# EAGLE design backup_board (EAGLE 7.7.0)
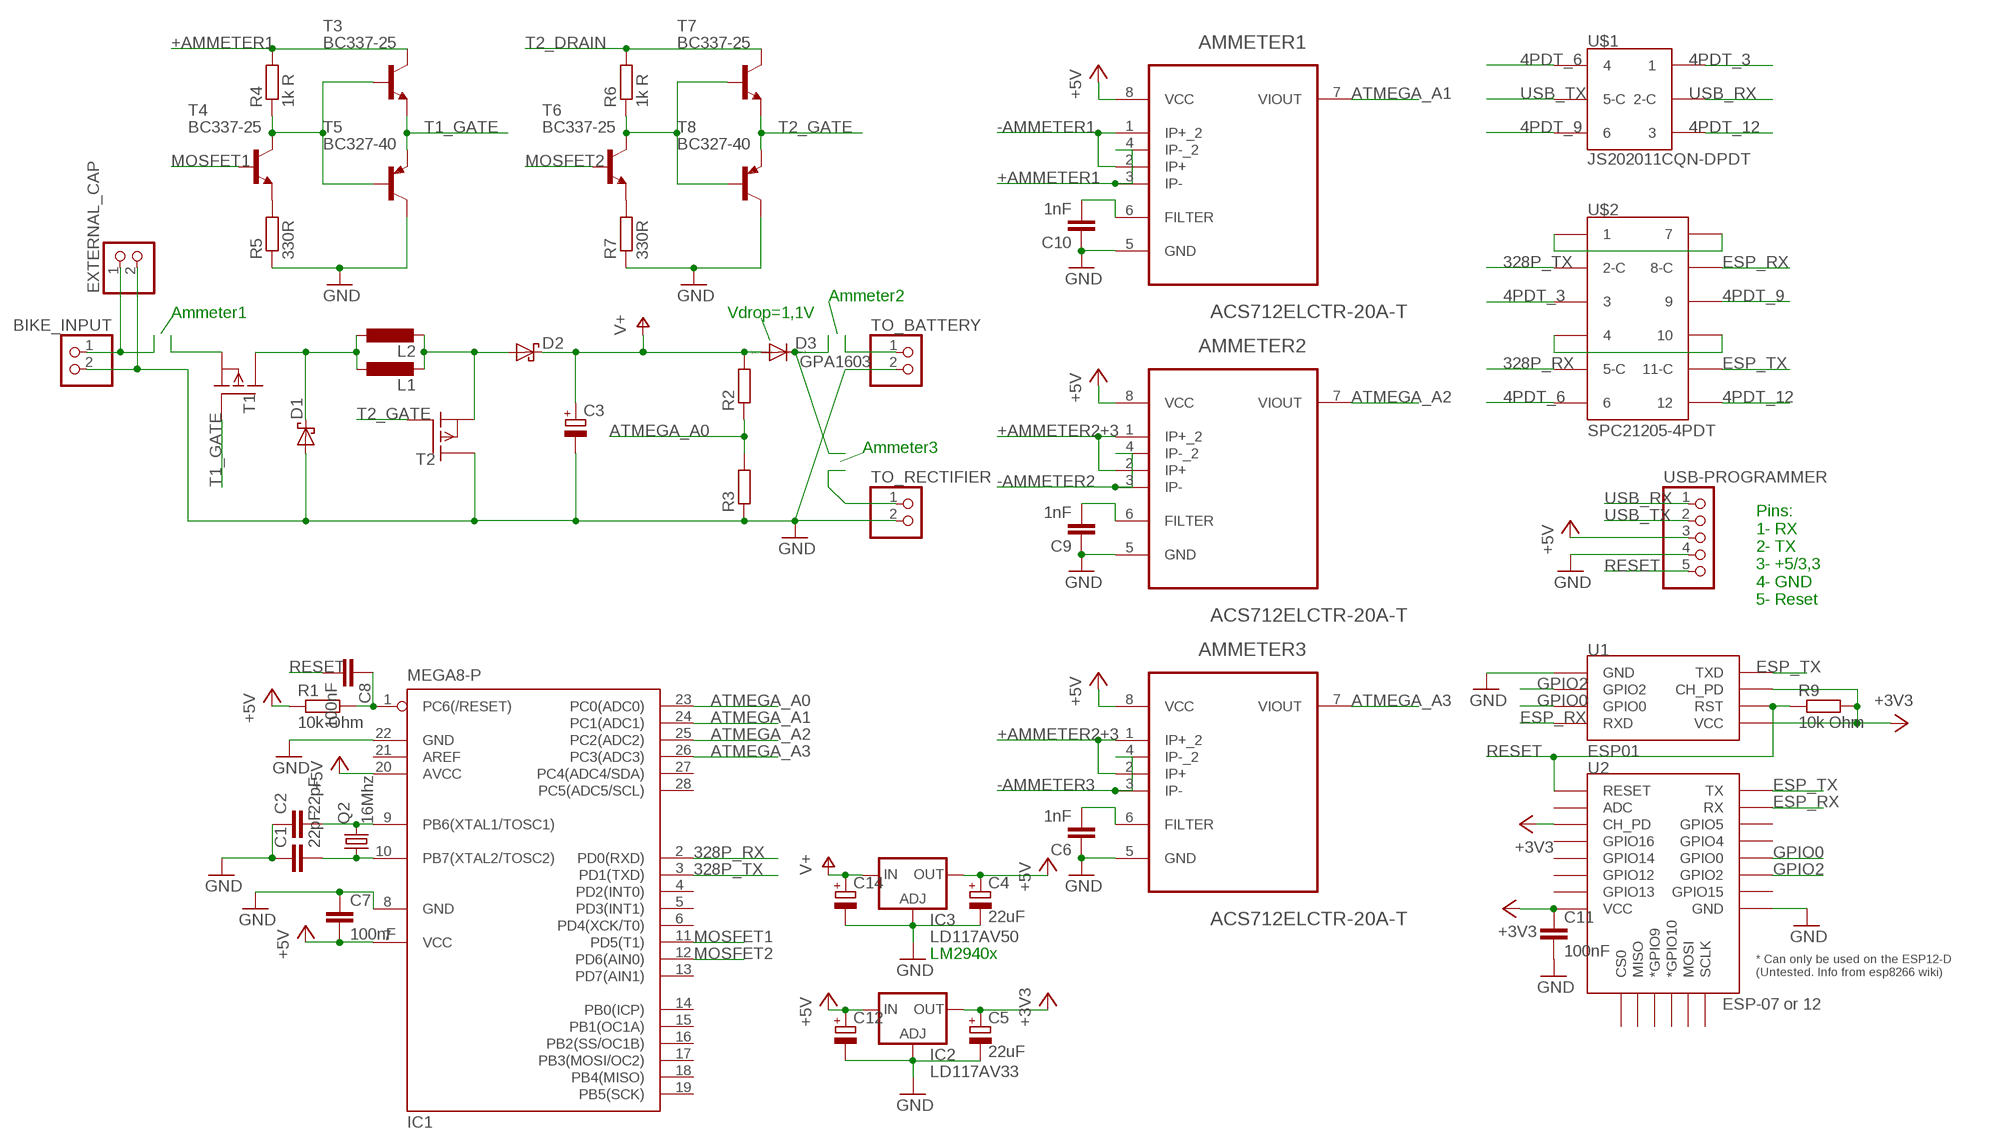
[diagram p0: schematic, sheet 1]

## Parts
AMMETER1  ACS712ELCTR-20A-T  [SOIC127P600X175-8N]
AMMETER2  ACS712ELCTR-20A-T  [SOIC127P600X175-8N]
AMMETER3  ACS712ELCTR-20A-T  [SOIC127P600X175-8N]
BIKE_INPUT  PINHD-1X2  [1X02]
C1  22pF  C-EU025-024X044  [C025-024X044]
C2  22pF  C-EU025-024X044  [C025-024X044]
C3  CPOL-EUE3.5-8  [E3,5-8]
C4  22uF  CPOL-EUE1.8-4  [E1,8-4]
C5  22uF  CPOL-EUE1.8-4  [E1,8-4]
C6  1nF  C-EU025-024X044  [C025-024X044]
C7  100nF  C-EU025-024X044  [C025-024X044]
C8  100nF  C-EU025-025X050  [C025-025X050]
C9  1nF  C-EU025-024X044  [C025-024X044]
C10  1nF  C-EU025-024X044  [C025-024X044]
C11  100nF  C-EU025-024X044  [C025-024X044]
C12  CPOL-EUE3.5-8  [E3,5-8]
C14  CPOL-EUE3.5-8  [E3,5-8]
D1  STPS1045  [TO220AC]
D2  STPS1045  [TO220AC]
D3  GPA1603  DIODE-C221B1A  [C221B1A]
EXTERNAL_CAP  PINHD-1X2  [1X02]
IC1  MEGA8-P  [DIL28-3]
IC2  LD117AV33  [TO220L1]
IC3  LD117AV50  [TO220L1]
L1  L-EUTJ4-U2  [TJ4-U2]
L2  L-EUTJ4-U2  [TJ4-U2]
Q2  16Mhz  CRYSTALHC49U70  [HC49U70]
R1  10k Ohm  R-EU_0204/7  [0204/7]
R2  R-EU_0207/10  [0207/10]
R3  R-EU_0207/10  [0207/10]
R4  1k R  R-EU_0207/10  [0207/10]
R5  330R  R-EU_0207/10  [0207/10]
R6  1k R  R-EU_0207/10  [0207/10]
R7  330R  R-EU_0207/10  [0207/10]
R9  10k Ohm  R-EU_0204/7  [0204/7]
T1  SUP65P06-20  [TO220]
T2  SUP65P06-20  [TO220]
T3  BC337-25  BC337-25-NPN-TO92-CBE  [TO92-CBE]
T4  BC337-25  BC337-25-NPN-TO92-CBE  [TO92-CBE]
T5  BC327-40  [TO92-EBC]
T6  BC337-25  BC337-25-NPN-TO92-CBE  [TO92-CBE]
T7  BC337-25  BC337-25-NPN-TO92-CBE  [TO92-CBE]
T8  BC327-40  [TO92-EBC]
TO_BATTERY  PINHD-1X2  [1X02]
TO_RECTIFIER  PINHD-1X2  [1X02]
U1  ESP01  [ESP01]
U2  ESP-07 or 12  ESP12ESMD  [ESP12E-SMD]
U$1  JS202011CQN-DPDT  [2X3_SWITCH]
U$2  SPC21205-4PDT  [2X6_SWITCH]
USB-PROGRAMMER  PINHD-1X5  [1X05]

## Nets
4PDT_3: U$1.1 U$2.3
4PDT_6: U$1.4 U$2.6
4PDT_9: U$1.6 U$2.9
4PDT_12: U$1.3 U$2.12
328P_RX: IC1.2(PD0(RXD)) U$2.5-C
328P_TX: IC1.3(PD1(TXD)) U$2.2-C
+3V3: C5.+ C11.1 IC2.2(OUT) R9.2 U1.CH_PD U1.VCC U2.CH_PD U2.VCC
+5V: AMMETER1.8(VCC) AMMETER2.8(VCC) AMMETER3.8(VCC) C4.+ C7.2 C12.+ IC1.7(VCC) IC1.20(AVCC) IC2.3(IN) IC3.2(OUT) R1.1 USB-PROGRAMMER.3
+AMMETER1: AMMETER1.3(IP-) AMMETER1.4(IP-_2) BIKE_INPUT.1 EXTERNAL_CAP.1 R4.2 T3.C
+AMMETER2+3: AMMETER2.1(IP+_2) AMMETER2.2(IP+) AMMETER3.1(IP+_2) AMMETER3.2(IP+) D3.C
-AMMETER1: AMMETER1.1(IP+_2) AMMETER1.2(IP+) T1.3(S)
-AMMETER2: AMMETER2.3(IP-) AMMETER2.4(IP-_2) TO_BATTERY.1
-AMMETER3: AMMETER3.3(IP-) AMMETER3.4(IP-_2) TO_RECTIFIER.1
ATMEGA_A0: IC1.23(PC0(ADC0)) R2.1 R3.2
ATMEGA_A1: AMMETER1.7(VIOUT) IC1.24(PC1(ADC1))
ATMEGA_A2: AMMETER2.7(VIOUT) IC1.25(PC2(ADC2))
ATMEGA_A3: AMMETER3.7(VIOUT) IC1.26(PC3(ADC3))
ESP_RX: U1.RX(RXD) U2.RXD0(RX) U$2.8-C
ESP_TX: U1.TX(TXD) U2.TXD0(TX) U$2.11-C
GND: AMMETER1.5(GND) AMMETER2.5(GND) AMMETER3.5(GND) BIKE_INPUT.2 C1.1 C2.1 C3.- C4.- C5.- C6.1 C7.1 C9.1 C10.1 C11.2 C12.- C14.- D1.A EXTERNAL_CAP.2 IC1.8(GND) IC1.22(GND) IC2.1(ADJ) IC3.1(ADJ) R3.1 R5.1 R7.1 T2.2(D) T5.C T8.C TO_BATTERY.2 TO_RECTIFIER.2 U1.GND U2.GND USB-PROGRAMMER.4
GPIO0: U1.GPIO0 U2.GPIO0
GPIO2: U1.GPIO2 U2.GPIO2
MOSFET1: IC1.11(PD5(T1)) T4.B
MOSFET2: IC1.12(PD6(AIN0)) T6.B
N$1: C1.2 IC1.10(PB7(XTAL2/TOSC2)) Q2.1
N$2: C2.2 IC1.9(PB6(XTAL1/TOSC1)) Q2.2
N$3: U$2.4 U$2.10
N$4: U$2.1 U$2.7
N$5: C8.1 IC1.1(PC6(/RESET)) R1.2
N$7: R7.2 T6.E
N$8: D1.C L1.1 L2.1 T1.2(D)
N$10: R5.2 T4.E
N$14: R6.1 T6.C T7.B T8.B
N$15: R4.1 T3.B T4.C T5.B
N$17: AMMETER3.6(FILTER) C6.2
N$19: AMMETER2.6(FILTER) C9.2
N$21: AMMETER1.6(FILTER) C10.2
RESET: C8.2 R9.1 U1.RST U2.RESET USB-PROGRAMMER.5
T1_GATE: T1.1(G) T3.E T5.E
T2_DRAIN: D2.A L1.2 L2.2 R6.2 T2.3(S) T7.C
T2_GATE: T2.1(G) T7.E T8.E
USB_RX: U$1.2-C USB-PROGRAMMER.1
USB_TX: U$1.5-C USB-PROGRAMMER.2
V+: C3.+ C14.+ D2.C D3.A IC3.3(IN) R2.2
Unconnected: IC1.4(PD2(INT0)) IC1.5(PD3(INT1)) IC1.6(PD4(XCK/T0)) IC1.13(PD7(AIN1)) IC1.14(PB0(ICP)) IC1.15(PB1(OC1A)) IC1.16(PB2(SS/OC1B)) IC1.17(PB3(MOSI/OC2)) IC1.18(PB4(MISO)) IC1.19(PB5(SCK)) IC1.21(AREF) IC1.27(PC4(ADC4/SDA)) IC1.28(PC5(ADC5/SCL)) U2.ADC U2.CS0 U2.GPIO4 U2.GPIO5 U2.GPIO9(*GPIO9) U2.GPIO10(*GPIO10) U2.GPIO12 U2.GPIO13 U2.GPIO14 U2.GPIO15 U2.GPIO16 U2.MISO U2.MOSI U2.SCLK

## Notes on the sheet
- Ammeter2
- Ammeter1 | Vdrop=1,1V
- Ammeter3
- Pins:
  1- RX
  2- TX
  3- +5/3,3
  4- GND
  5- Reset
- LM2940x

## Library data of the parts
AMMETER1-AMMETER3 = ACS712-20A_Farnell:ACS712ELCTR-20A-T: Linear Current Sensor; MPN: ACS712ELCTR-20A-T; OC_FARNELL: 1329624; OC_NEWARK: 31M3133; PACKAGE: SOIC-8; SUPPLIER: Allegro
BIKE_INPUT EXTERNAL_CAP TO_BATTERY TO_RECTIFIER = pinhead:PINHD-1X2: PIN HEADER
C1 C2 C6-C11 = rcl:C-EU: CAPACITOR, European symbol
C3-C5 C12 C14 = rcl:CPOL-EU: POLARIZED CAPACITOR, European symbol
D1 D2 = stps1045_own:STPS1045: DIODE barrier rectifier, 7.5 A, 50 V
D3 = diode:DIODE-: DIODE
IC1 = atmel:MEGA8-P: MICROCONTROLLER 8 Kbytes FLASH, 1 kbytes SRAM, 512 bytes EEPROM, USART, 4-channel 10 bit ADC, 2-channel 8 bit ADC Pin compatible with Atmega48, ATMega88, ATMega168 Source: avr.lbr; OC_FARNELL: unknown; OC_NEWARK: unknown
IC2 IC3 = v-reg:LD117A?*: Low drop fixed and adjustable positive voltage regulators 1 A Source: http://www.st.com/stonline/products/literature/ds/7194/ld1117axx.pdf
L1 L2 = rcl:L-EU: INDUCTOR, European symbol
Q2 = crystal:CRYSTAL: CRYSTAL; OC_FARNELL: unknown; OC_NEWARK: unknown
R1 R9 = rcl:R-EU_: RESISTOR, European symbol
R2-R7 = resistor:R-EU_: RESISTOR, European symbol
T1 T2 = transistor-fet:SUP65P06-20: P-Channel Enhancement MOSFET -60V; 60A; 0,020Ohm
T3 T4 T6 T7 = transistor:*-NPN-: NPN Transistror BF959 corrected 2008.03.06
T5 T8 = transistor-pnp:BC327*: PNP Transistror
U1 = esp8266modules:ESP01: ESP8266 Wifi module 01
U2 = esp8266modules:ESP12E: ESP12E Module
U$1 = Library_TW:JS202011CQN-DPDT
U$2 = Library_TW:SPC21205-4PDT
USB-PROGRAMMER = pinhead:PINHD-1X5: PIN HEADER

## Board
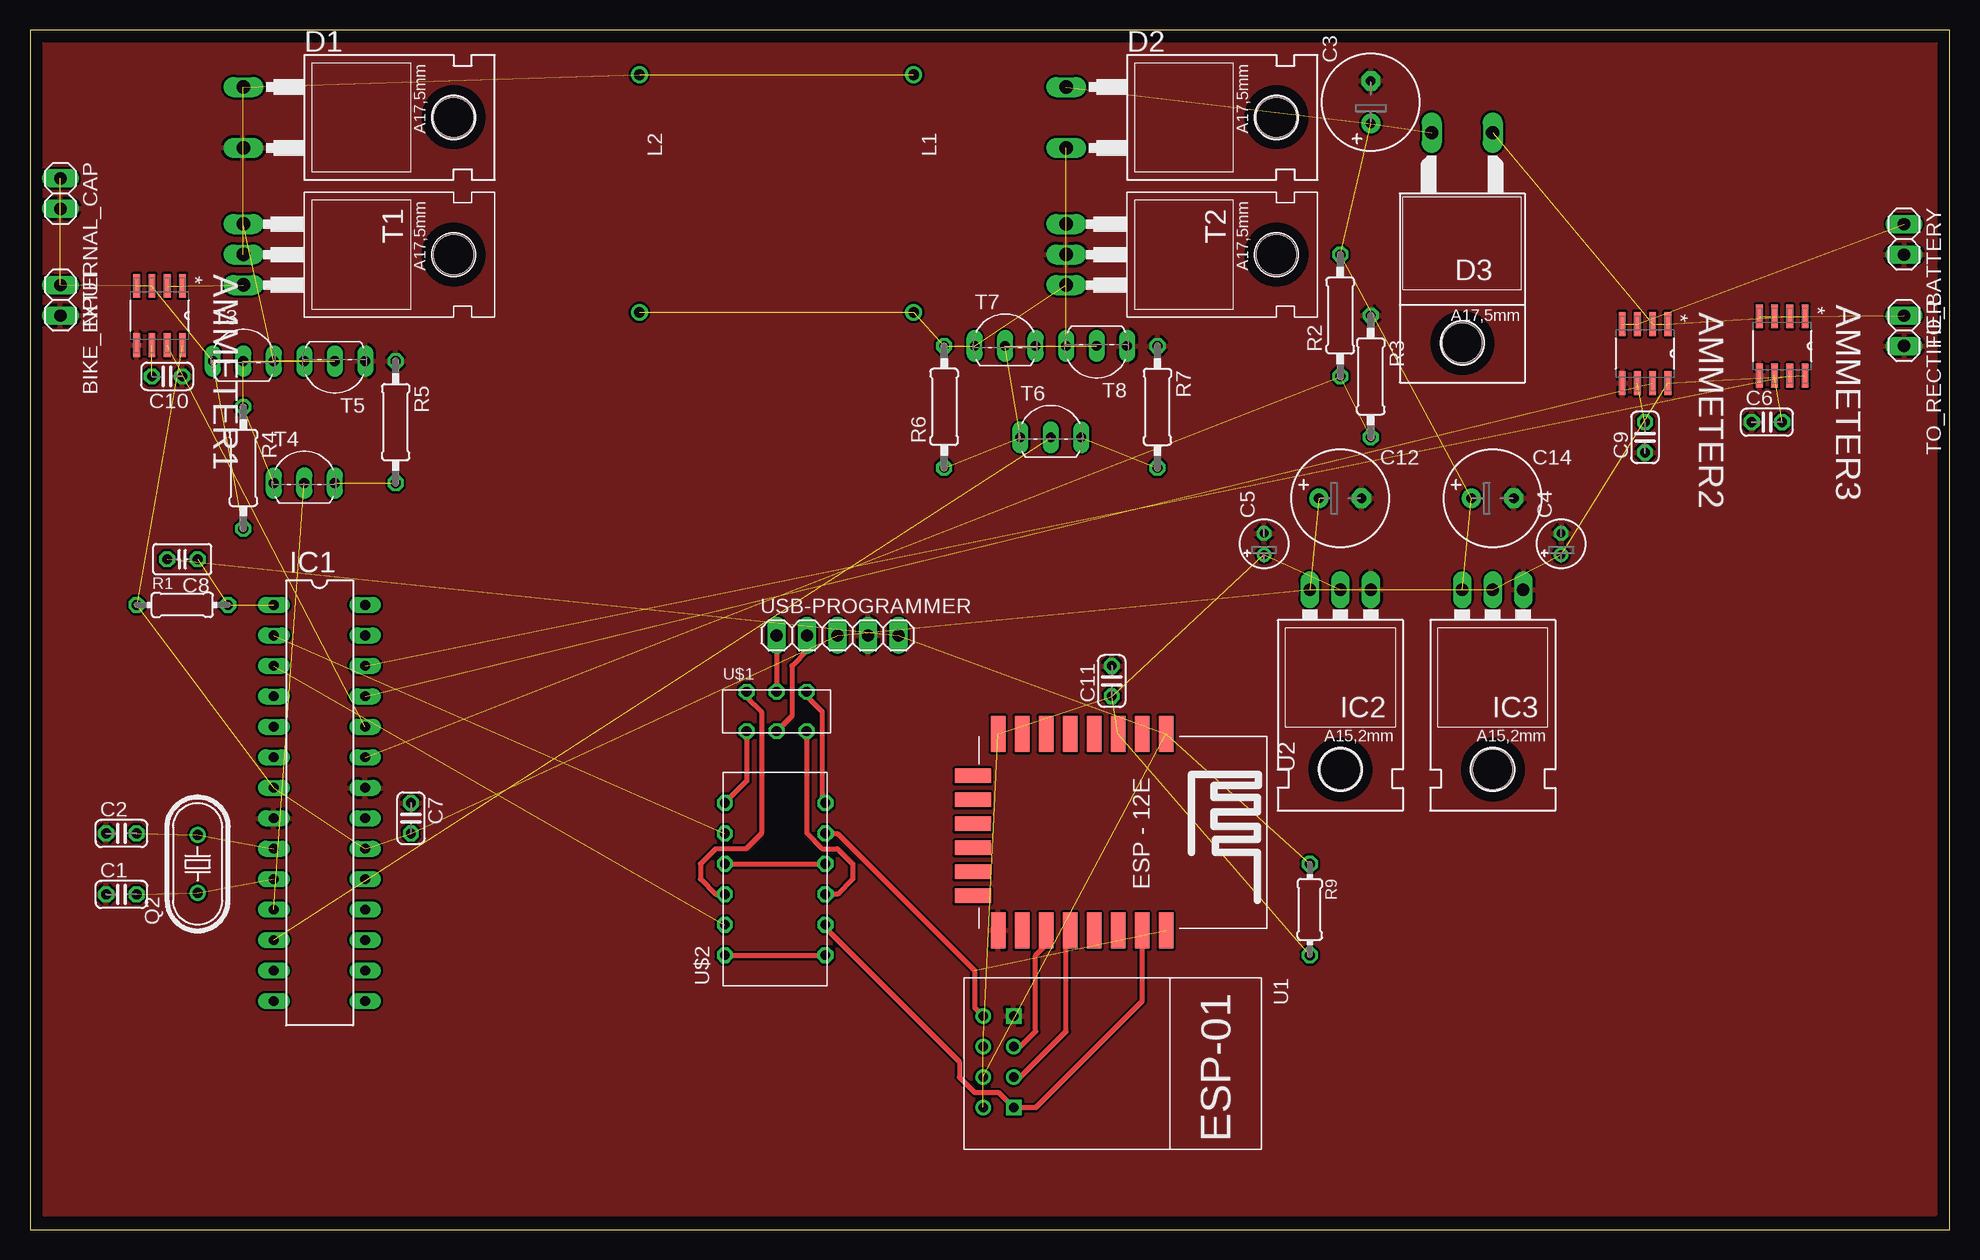
[diagram p1: board, top side]

Size 160 x 100 mm. Coordinates in mm from the lower left corner, seen from the top.
Outline: 0,0 160,0 160,100 0,100 0,0
Copper layers (1*16): Top 0.035mm / dielectric 1.5mm / Bottom 0.035mm
Design rules "default": minimum track width 10mil, minimum drill 24mil, track to track 8mil, track to pad 8mil, pad to pad 8mil, via to via 8mil, smd to smd 8mil, copper to edge 40mil, drill to drill 8mil, minimum pad ring 10mil, minimum via ring 8mil, stop-mask expansion 4mil, vias tented up to drill 0mil, thermal gap 10mil

### Footprints (pad centres in the part's own frame; a part is rotated, then mirrored left to right if it is on the bottom)
SOIC127P600X175-8N = smd 1.981 x 0.559: 1 -2.464,1.905; 2 -2.464,0.635; 3 -2.464,-0.635; 4 -2.464,-1.905; 5 2.464,-1.905; 6 2.464,-0.635; 7 2.464,0.635; 8 2.464,1.905
1X02 = drill 1.016 long: 1 -1.27,0; 2 1.27,0
C025-024X044 = drill 0.813 octagon: 1 -1.27,0; 2 1.27,0
E3,5-8 = drill 0.813 pad 1.6: + -1.778,0 | drill 0.813 pad 1.6 octagon: - 1.778,0
E1,8-4 = drill 0.711 pad 1.168: + -0.889,0 | drill 0.711 pad 1.168 octagon: - 0.889,0
C025-025X050 = drill 0.813 octagon: 1 -1.27,0; 2 1.27,0
TO220AC = drill 1.118 long: A 2.54,-6.35; C -2.54,-6.35 | hole 3.302: 0,11.176
C221B1A = drill 1.118 long: A 2.54,-6.35; C -2.54,-6.35 | hole 3.302: 0,11.176
DIL28-3 = drill 0.813 long: 1 -16.51,-3.81; 2 -13.97,-3.81; 3 -11.43,-3.81; 4 -8.89,-3.81; 5 -6.35,-3.81; 6 -3.81,-3.81; 7 -1.27,-3.81; 8 1.27,-3.81; 9 3.81,-3.81; 10 6.35,-3.81; 11 8.89,-3.81; 12 11.43,-3.81; 13 13.97,-3.81; 14 16.51,-3.81; 15 16.51,3.81; 16 13.97,3.81; 17 11.43,3.81; 18 8.89,3.81; 19 6.35,3.81; 20 3.81,3.81; 21 1.27,3.81; 22 -1.27,3.81; 23 -3.81,3.81; 24 -6.35,3.81; 25 -8.89,3.81; 26 -11.43,3.81; 27 -13.97,3.81; 28 -16.51,3.81
TO220L1 = drill 1.016 long: 1 -2.54,-3.81; 2 0,-3.81; 3 2.54,-3.81 | hole 3.302: 0,11.176
TJ4-U2 = drill 0.9: 1 -9.9,0; 2 9.9,0
HC49U70 = drill 0.813: 1 -2.413,0; 2 2.413,0
0204/7 = drill 0.813 octagon: 1 -3.81,0; 2 3.81,0
0207/10 = drill 0.813 octagon: 1 -5.08,0; 2 5.08,0
TO220 = drill 1.118 long: 1 -2.54,-6.35; 2 0,-6.35; 3 2.54,-6.35 | hole 3.302: 0,11.176
TO92-CBE = drill 0.813 long: B 0,0; C -2.54,0; E 2.54,0
TO92-EBC = drill 0.813 long: B 0,-1.27; C -2.54,-1.27; E 2.54,-1.27
ESP01 = drill 0.8: CH_PD -1.285,-8.178; GPIO0 1.255,-5.638; GPIO2 -1.285,-5.638; RST 1.255,-8.178; TX -3.825,-8.178; VCC 3.795,-8.178 | drill 0.8 square: GND -3.825,-5.638; RX 3.795,-5.638
ESP12E-SMD = smd 3 x 1.2: ADC -8.3,3.8; CH_PD -8.3,1.8; GND 8.1,-8.2; GPIO0 8.1,-2.2; GPIO2 8.1,-4.2; GPIO4 8.1,-0.2; GPIO5 8.1,1.8; GPIO12 -8.3,-4.2; GPIO13 -8.3,-6.2; GPIO14 -8.3,-2.2; GPIO15 8.1,-6.2; GPIO16 -8.3,-0.2; RESET -8.3,5.8; RXD0 8.1,3.8; TXD0 8.1,5.8; VCC -8.3,-8.2 | smd 1.2 x 3: CS0 -4.8,-10.3; GPIO9 -0.8,-10.3; GPIO10 1.2,-10.3; MISO -2.8,-10.3; MOSI 3.2,-10.3; SCLK 5.2,-10.3
2X3_SWITCH = drill 0.8 octagon: 1 -2.5,1.65; 2-C 0,1.65; 3 2.5,1.65; 4 -2.5,-1.65; 5-C 0,-1.65; 6 2.5,-1.65
2X6_SWITCH = drill 0.8 octagon: 1 -6.35,4.325; 2-C -3.81,4.325; 3 -1.27,4.325; 4 1.27,4.325; 5-C 3.81,4.325; 6 6.35,4.325; 7 -6.35,-4.075; 8-C -3.81,-4.075; 9 -1.27,-4.075; 10 1.27,-4.075; 11-C 3.81,-4.075; 12 6.35,-4.075
1X05 = drill 1.016 long: 1 -5.08,0; 2 -2.54,0; 3 0,0; 4 2.54,0; 5 5.08,0

### Placement (x,y rotation side)
AMMETER1  10.79,76.2 270 top
AMMETER2  134.62,73.03 270 top
AMMETER3  146.05,73.66 270 top
BIKE_INPUT  2.54,77.47 270 top
C1  7.62,27.94 0 top
C2  7.62,33.02 0 top
C3  111.76,93.98 90 top
C4  127.64,57.15 90 top
C5  102.87,57.15 90 top
C6  144.78,67.31 0 top
C7  31.75,34.29 270 top
C8  12.7,55.88 180 top
C9  134.62,66.04 90 top
C10  11.43,71.12 180 top
C11  90.17,45.72 90 top
C12  109.22,60.96 0 top
C14  121.92,60.96 0 top
D1  24.13,92.71 270 top
D2  92.71,92.71 270 top
D3  119.38,85.09 180 top
EXTERNAL_CAP  2.54,86.36 270 top
IC1  24.13,35.56 270 top
IC2  109.22,49.53 180 top
IC3  121.92,49.53 180 top
L1  73.66,86.36 270 top
L2  50.8,86.36 270 top
Q2  13.97,30.48 90 top
R1  12.7,52.07 0 top
R2  109.22,76.2 90 top
R3  111.76,71.12 270 top
R4  17.78,63.5 270 top
R5  30.48,67.31 270 top
R6  76.2,68.58 90 top
R7  93.98,68.58 270 top
R9  106.68,26.67 270 top
T1  24.13,81.28 270 top
T2  92.71,81.28 270 top
T3  17.78,72.39 0 top
T4  22.86,62.23 0 top
T5  25.4,71.12 180 top
T6  85.09,66.04 0 top
T7  81.28,73.66 0 top
T8  88.9,72.39 180 top
TO_BATTERY  156.21,82.55 270 top
TO_RECTIFIER  156.21,74.93 270 top
U1  87.63,13.97 270 top
U2  88.9,33.02 270 top
U$1  62.23,43.18 0 top
U$2  62.23,29.21 90 top
USB-PROGRAMMER  67.31,49.53 0 top

### Tracks (layer width: path | path; a pad name or v marks a point on that pad's centre or on a via)
4PDT_3
  Top 0.406: U$1.1 59.73,44.41 60.96,43.18 60.96,33.02 59.69,31.75 57.15,31.75 55.88,30.48 55.88,29.21 57.15,27.94 U$2.3
4PDT_6
  Top 0.406: U$1.4 59.73,37.38 U$2.6
4PDT_9
  Top 0.406: U$1.6 64.73,33.06 66.04,31.75 67.31,31.75 68.58,30.48 68.58,29.21 67.31,27.94 U$2.9
4PDT_12
  Top 0.406: U$1.3 64.73,44.49 66.04,43.18 66.04,35.83 U$2.12
328P_RX  (1 unrouted)
328P_TX  (1 unrouted)
+3V3  (7 unrouted)
+5V  (11 unrouted)
+AMMETER1  (5 unrouted)
+AMMETER2+3  (4 unrouted)
-AMMETER1  (2 unrouted)
-AMMETER2  (2 unrouted)
-AMMETER3  (2 unrouted)
ATMEGA_A0  (2 unrouted)
ATMEGA_A1  (1 unrouted)
ATMEGA_A2  (1 unrouted)
ATMEGA_A3  (1 unrouted)
ESP_RX
  Top 0.406: U2.RXD0 92.71,19.05 83.83,10.18 U1.RX 80.74,11.43 78.74,11.43 77.47,12.7 77.47,13.97 66.31,25.14 U$2.8-C
ESP_TX  (1 unrouted)
  Top 0.406: U$2.11-C 67.31,33.02 78.74,21.59 78.74,18.51 U1.TX
GND
  pour Top: 158.75,1.27 1.27,1.27 1.27,99.06 158.75,99.06
GPIO0
  Top 0.406: U1.GPIO0 82.56,12.71 86.36,16.51 86.36,24.58 U2.GPIO0
GPIO2
  Top 0.406: U1.GPIO2 82.56,15.26 83.82,16.51 83.82,22.86 85.09,24.13 85.09,24.53 U2.GPIO2
MOSFET1  (1 unrouted)
MOSFET2  (1 unrouted)
N$1  (2 unrouted)
N$2  (2 unrouted)
N$3
  Top 0.406: U$2.4 U$2.10
N$4
  Top 0.406: U$2.1 U$2.7
N$5  (2 unrouted)
N$7  (1 unrouted)
N$8  (3 unrouted)
N$10  (1 unrouted)
N$14  (3 unrouted)
N$15  (3 unrouted)
N$17  (1 unrouted)
N$19  (1 unrouted)
N$21  (1 unrouted)
RESET  (4 unrouted)
T1_GATE  (2 unrouted)
T2_DRAIN  (5 unrouted)
T2_GATE  (2 unrouted)
USB_RX
  Top 0.406: USB-PROGRAMMER.1 U$1.2-C
USB_TX
  Top 0.406: USB-PROGRAMMER.2 64.77,48.26 63.5,46.99 63.5,42.8 U$1.5-C
V+  (5 unrouted)